# Altium schematic sheet Tag102 Rev15.schdoc
size 292 x 193 mm; SheetNumber: 0; SheetTotal: 0
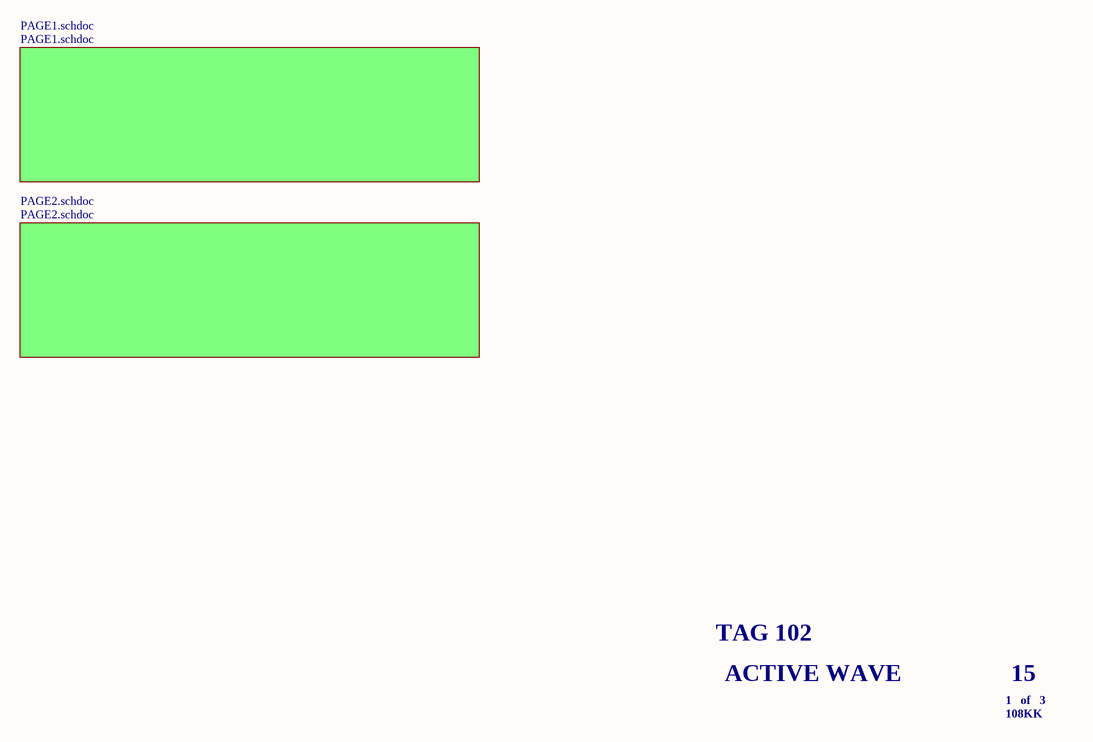
[diagram p0: Tag102 Rev15.schdoc]

## Sub-sheets
PAGE1.schdoc = PAGE1.schdoc: no entries
PAGE2.schdoc = PAGE2.schdoc: no entries

## Notes on the sheet
- TAG 102
- ACTIVE WAVE
- 1   of   3
- 15
- 108KK